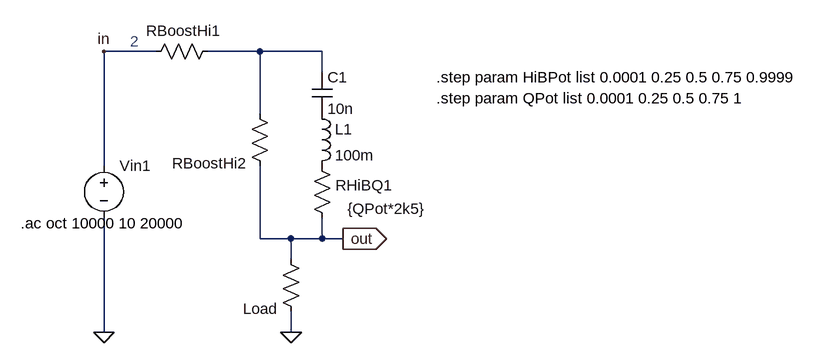
[diagram p0: schematic HighPeak.asc]
HighPeak.asc, the LTspice schematic file:
Version 4
SHEET 1 1068 852
WIRE 32 96 -48 96
WIRE 192 96 112 96
WIRE 288 96 192 96
WIRE 288 128 288 96
WIRE 192 192 192 96
WIRE -48 272 -48 96
WIRE 192 384 192 272
WIRE 240 384 192 384
WIRE 288 384 288 352
WIRE 288 384 240 384
WIRE 320 384 288 384
WIRE 240 416 240 384
WIRE -48 528 -48 352
WIRE 240 528 240 496
FLAG -48 528 0
FLAG -48 96 in
FLAG 240 528 0
FLAG 320 384 out
IOPIN 320 384 Out
SYMBOL cap 272 128 R0
SYMATTR InstName C1
SYMATTR Value 10n
SYMBOL ind 272 176 R0
SYMATTR InstName L1
SYMATTR Value 100m
SYMBOL res 128 80 R90
WINDOW 0 0 54 VBottom 2
WINDOW 3 -10 54 Invisible 2
SYMATTR InstName RBoostHi1
SYMATTR Value {(1-HiBPot)*10k}
SYMBOL res 208 288 R180
WINDOW 0 36 20 Left 2
WINDOW 3 36 48 Invisible 2
SYMATTR InstName RBoostHi2
SYMATTR Value {HiBPot*10k}
SYMBOL res 304 368 R180
WINDOW 0 -92 66 Left 2
WINDOW 3 -142 30 Left 2
SYMATTR InstName RHiBQ1
SYMATTR Value {QPot*2k5}
SYMBOL voltage -48 256 R0
WINDOW 3 24 96 Invisible 2
SYMATTR Value ""
SYMATTR Value2 AC 1
SYMATTR InstName Vin1
SYMBOL res 256 512 R180
WINDOW 0 36 20 Left 2
WINDOW 3 36 48 Invisible 2
SYMATTR InstName Load
SYMATTR Value 50
TEXT -8 80 Left 2 ;2
TEXT 464 136 Left 2 !.step param HiBPot list 0.0001 0.25 0.5 0.75 0.9999
TEXT 464 168 Left 2 !.step param QPot list 0.0001 0.25 0.5 0.75 1
TEXT -176 360 Left 2 !.ac oct 10000 10 20000

The netlist it stands for:
* HighPeak.asc
C1 N001 P001 10n
L1 P001 P002 100m
RBoostHi1 N001 in {(1-HiBPot)*10k}
RBoostHi2 out N001 {HiBPot*10k}
RHiBQ1 out P002 {QPot*2k5}
Vin1 in 0 AC 1
R§Load 0 out 50
* 2
.step param HiBPot list 0.0001 0.25 0.5 0.75 0.9999
.step param QPot list 0.0001 0.25 0.5 0.75 1
.ac oct 10000 10 20000
.backanno
.end